# Altium schematic sheet Analog_project.SchDoc
size Letter; SheetNumber: 1; SheetTotal: 1
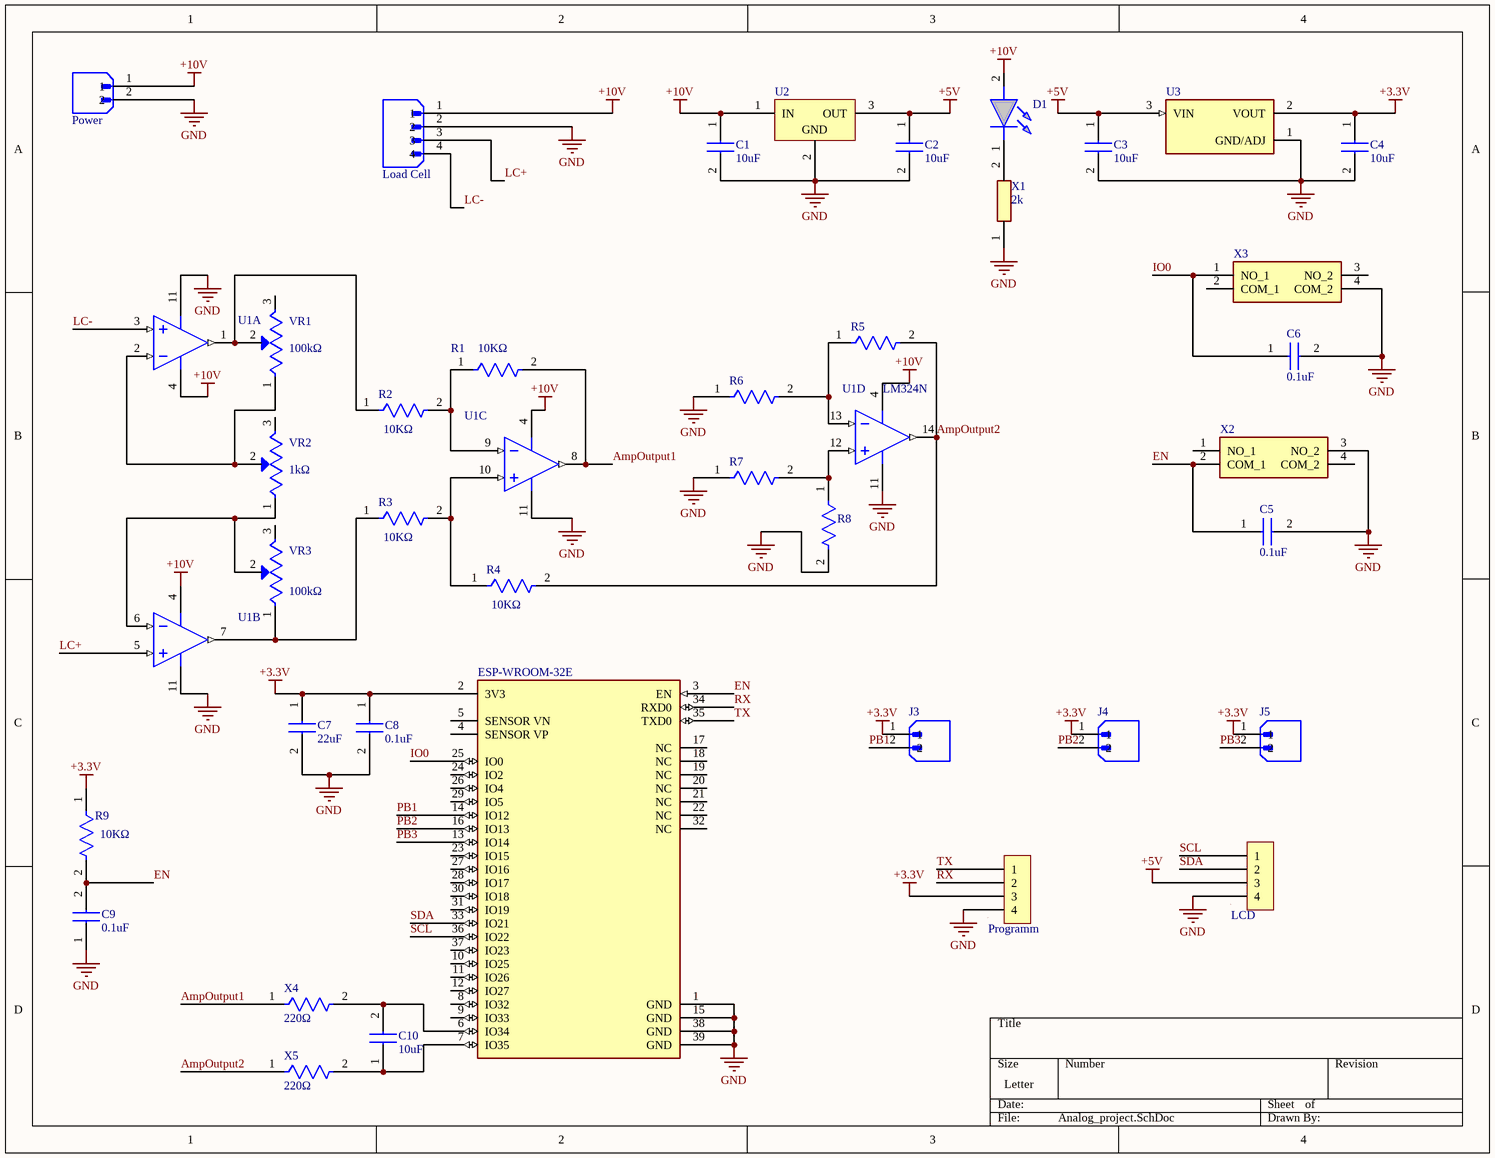
[diagram p0: Analog_project.SchDoc]

## Parts
C1  Capacitance: 10uF  [CAPC3216X180N]  (hidden comment: C1206C106K8RAC)
C2  Capacitance: 10uF  [CAPC3216X180N]  (hidden comment: C1206C106K8RAC)
C3  Capacitance: 10uF  [CAPC3216X180N]  (hidden comment: C1206C106K8RAC)
C4  Capacitance: 10uF  [CAPC3216X180N]  (hidden comment: C1206C106K8RAC)
C5  Capacitance: 0.1uF  [CAPC3216X110N]  (hidden comment: C1206C104K5RAC7867)
C6  Capacitance: 0.1uF  [CAPC3216X110N]  (hidden comment: C1206C104K5RAC7867)
C7  Capacitamce: 22uF  [CAPC2012X150N]  (hidden comment: CL31B226KPKVPJE)
C8  Capacitance: 0.1uF  [CAPC3216X110N]  (hidden comment: C1206C104K5RAC7867)
C9  Capacitance: 0.1uF  [CAPC3216X110N]  (hidden comment: C1206C104K5RAC7867)
C10  Capacitance: 10uF  [CAPC3216X180N]  (hidden comment: C1206C106K8RAC)
D1  150120GS75000  [LEDC3214X78N]  (value not drawn)
ESP-WROOM-32E  ESP32-WROOM-32E (16MB)  [FP-ESP32-WROOM-32E_16MB-MFG]  (value not drawn)
J3  B2B-XH-A(LF)(SN)  [JST_B2B-XH-A(LF)(SN)]  (value not drawn)
J4  B2B-XH-A(LF)(SN)  [JST_B2B-XH-A(LF)(SN)]  (value not drawn)
J5  B2B-XH-A(LF)(SN)  [JST_B2B-XH-A(LF)(SN)]  (value not drawn)
LCD  61300411121  [61300411121]  (value not drawn)
Load_Cell  B4B-XH-A(LF)(SN)  [JST_B4B-XH-A(LF)(SN)]  (value not drawn)
Power  B2B-XH-A(LF)(SN)  [JST_B2B-XH-A(LF)(SN)]  (value not drawn)
Programm  61300411121  [61300411121]  (value not drawn)
R1  value 10KΩ  [FP-CRGP1210-IPC_A]  (hidden comment: CRGP1210F10K)
R2  value 10KΩ  [FP-CRGP1210-IPC_A]  (hidden comment: CRGP1210F10K)
R3  value 10KΩ  [FP-CRGP1210-IPC_A]  (hidden comment: CRGP1210F10K)
R4  value 10KΩ  [FP-CRGP1210-IPC_A]  (hidden comment: CRGP1210F10K)
R5  CRGP1210F10K  [FP-CRGP1210-IPC_A]  (value not drawn)
R6  CRGP1210F10K  [FP-CRGP1210-IPC_A]  (value not drawn)
R7  CRGP1210F10K  [FP-CRGP1210-IPC_A]  (value not drawn)
R8  CRGP1210F10K  [FP-CRGP1210-IPC_A]  (value not drawn)
R9  value 10KΩ  [FP-CRGP1210-IPC_A]  (hidden comment: CRGP1210F10K)
U1  LM324N  [N0014A]  (value not drawn)  (parts A,B,C,D of 4)
U2  L7805ACV  [TO220]  (value not drawn)
U3  AMS1117-3.3  [SOT229P700X180-4N]  (value not drawn)
VR1  value 100kΩ  [TRIM_3296W-OT1-103]  (hidden comment: 3296W-OT1-103)
VR2  value 1kΩ  [TRIM_3296W-OT1-103]  (hidden comment: 3296W-OT1-103)
VR3  value 100kΩ  [TRIM_3296W-OT1-103]  (hidden comment: 3296W-OT1-103)
X1  Resistance: 2k  [RESC3116X65X50LL20T20]  (hidden comment: CHP1206AFX-2001ELF)
X2  TS04-66-65-BK-160-SMT  [TS046665BK160SMT]  (value not drawn)
X3  TS04-66-65-BK-160-SMT  [TS046665BK160SMT]  (value not drawn)
X4  Resistance: 220Ω  [RESC3216X60N]  (hidden comment: RCC1206220RFKEA)
X5  Resistance: 220Ω  [RESC3216X60N]  (hidden comment: RCC1206220RFKEA)

## Nets
+3.3V: C4.1 C7.1 C8.1 ESP-WROOM-32E.2(3V3) J3.1 J4.1 J5.1 Programm.3 R9.1 U3.2(VOUT)
+5V: C2.1 C3.1 LCD.3 U2.3(OUT) U3.3(VIN)
+10V: C1.1 D1.2(A) Load_Cell.1 Power.1 U1.4(V+) U2.1(IN)
GND: C1.2 C2.2 C3.2 C4.2 C5.2 C6.2 C7.2 C8.2 C9.1 ESP-WROOM-32E.1(GND) ESP-WROOM-32E.15(GND) ESP-WROOM-32E.38(GND) ESP-WROOM-32E.39(GND) LCD.4 Load_Cell.2 Power.2 Programm.4 R6.1 R7.1 R8.2 U1.11(GND) U2.2(GND) U3.1(GND/ADJ) X1.1 X2.3(NO_2) X3.4(COM_2)
AmpOutput1: R1.2 U1.8(OUT3) X4.1
AmpOutput2: R4.2 R5.2 U1.14(OUT4) X5.1
EN: C5.1 C9.2 ESP-WROOM-32E.3(EN) R9.2 X2.2(COM_1)
IO0: C6.1 ESP-WROOM-32E.25(IO0) X3.1(NO_1)
LC+: Load_Cell.3 U1.5(IN2+)
LC-: Load_Cell.4 U1.3(IN1+)
PB1: ESP-WROOM-32E.14(IO12) J3.2
PB2: ESP-WROOM-32E.16(IO13) J4.2
PB3: ESP-WROOM-32E.13(IO14) J5.2
RX: ESP-WROOM-32E.34(RXD0) Programm.2
SCL: ESP-WROOM-32E.36(IO22) LCD.1
SDA: ESP-WROOM-32E.33(IO21) LCD.2
TX: ESP-WROOM-32E.35(TXD0) Programm.1
NetC10_1: C10.1 ESP-WROOM-32E.7(IO35) X5.2
NetC10_2: C10.2 ESP-WROOM-32E.6(IO34) X4.2
NetD1_1: D1.1(K) X1.2
NetR1_1: R1.1 R2.2 U1.9(IN3-)
NetR2_1: R2.1 U1.1(OUT1) VR1.2(WIPER)
NetR3_1: R3.1 U1.7(OUT2) VR3.1(CCW)
NetR3_2: R3.2 R4.1 U1.10(IN3+)
NetR5_1: R5.1 R6.2 U1.13(IN4-)
NetR7_2: R7.2 R8.1 U1.12(IN4+)
NetU1_2: U1.2(IN1-) VR1.1(CCW) VR2.2(WIPER)
NetU1_6: U1.6(IN2-) VR2.1(CCW) VR3.2(WIPER)

Not connected (* = marked no-connect by the designer): ESP-WROOM-32E 4(SENSOR_VP) 5(SENSOR_VN) 8(IO32) 9(IO33) 10(IO25) 11(IO26) 12(IO27) 17(NC) 18(NC) 19(NC) 20(NC) 21(NC) 22(NC) 23(IO15) 24(IO2) 26(IO4) 27(IO16) 28(IO17) 29(IO5) 30(IO18) 31(IO19) 32(NC) 37(IO23); VR1 3(CW); VR2 3(CW); VR3 3(CW); X2 1(NO_1) 4(COM_2); X3 2(COM_1) 3(NO_2)

## Library data of the parts
C1-C4 C10 = C1206C106K8RAC: Multilayer Ceramic Capacitors MLCC - SMD/SMT 10V 10uF X7R 1206 0.1; Manufacturer_Name: KEMET; Geometry.Height: 1.8mm; Mouser Part Number: 80-C1206C106K8RAC; Mouser Price/Stock: https://www.mouser.co.uk/ProductDetail/KEMET/C1206C106K8RAC?qs=IIhARexJuViDIgySPNv42g%3D%3D; Manufacturer_Part_Number: C1206C106K8RAC; Datasheet Link: https://www.mouser.in/datasheet/2/212/KEM_C1002_X7R_SMD-1102033.pdf
C5 C6 C8 C9 = C1206C104K5RAC7867: Multilayer Ceramic Capacitors MLCC - SMD/SMT 50V 0.1uF X7R 1206 10%; Manufacturer_Name: KEMET; Geometry.Height: 1.1mm; Mouser Part Number: 80-C1206104K5RAC7867; Mouser Price/Stock: https://www.mouser.co.uk/ProductDetail/KEMET/C1206C104K5RAC7867?qs=r%2FVmNO8Tjq5MvP%2FjoJQjcw%3D%3D; Manufacturer_Part_Number: C1206C104K5RAC7867; Datasheet Link: https://content.kemet.com/datasheets/KEM_C1002_X7R_SMD.pdf
C7 = CL31B226KPKVPJE: General Multilayer Ceramic Capacitors; Manufacturer_Name: SAMSUNG; Geometry.Height: 1.5mm; Mouser Part Number: 187-CL31B226KPKVPJE; Mouser Price/Stock: https://www.mouser.co.uk/ProductDetail/Samsung-Electro-Mechanics/CL31B226KPKVPJE?qs=Jm2GQyTW%2Fbh6Hm6JEZyOWg%3D%3D; Manufacturer_Part_Number: CL31B226KPKVPJE; Datasheet Link: *
D1 = 150120GS75000: LED,Wurth Elektronik,150120GS75000 Wurth Elektronik 150120GS75000, WL-SMCW Series Green LED, 520 nm, 3016 (1206) Clear, Rectangle Lens SMD Package; Geometry.Height: 0.78mm; Mouser Part Number: 710-150120GS75000; Mouser Price/Stock: https://www.mouser.co.uk/ProductDetail/Wurth-Elektronik/150120GS75000?qs=LlUlMxKIyB3I3AMxrmBw4A%3D%3D; Manufacturer_Name: Wurth Elektronik; Manufacturer_Part_Number: 150120GS75000; Datasheet Link: *
ESP-WROOM-32E = CMP-194065-000027-1: RX TXRX MOD WIFI TRACE ANT SMD
J3-J5 Power = B2B-XH-A(LF)(SN): Connector Header Through Hole 2 position 0.098 (2.50mm); MF: JST Sales America Inc.; SnapEDA_Link: https://www.snapeda.com/parts/B2B-XH-A(LF)(SN)/JST+Sales+America+Inc./view-part/?ref=snap; Package: None; Value: *; MP: B2B-XH-A(LF)(SN); Check_prices: https://www.snapeda.com/parts/B2B-XH-A(LF)(SN)/JST+Sales+America+Inc./view-part/?ref=eda
LCD Programm = 61300411121: Board Connector, 4 Contact(s), 1 Row(s), Male, Straight, 0.1 inch Pitch, Solder Terminal, Locking, Black Insulator, Plug; Manufacturer: Wurth Electronics; Contact Pattern: RECTANGULAR; Contact Resistance: 20mR; Contact Style: SQ PIN-SKT; Dielectric Withstanding Voltage (AC): 500V; Insulation Resistance: 1GR; Number Of Connectors: 1; Rated Current (Signal): 3A; Number of Contacts: 4; Body Length: 0.4inch; Reference Standard: UL; Reliability: COMMERCIAL; Supplier: Digi-Key; Supplier Part Number: 732-5317-ND; Manufacturer Part Number: 61300411121; RoHS: Yes; Category: Headers and Wire Housings; Stock: 103058; Pricing: 1=0.19, 10=0.163, 25=0.1352, 50=0.113, 100=0.102, 1000=0.094 (USD); Mounting Technology: Board; Contact Material: Copper Alloy; Contact Finish - Mating: GOLD; Contact Finish - Termination: Gold (Au) - with Nickel (Ni) barrier; Insulation Color: Black; Insulation Material: Polybutylene; Min Operating Temperature: -40°C; Max Operating Temperature: 125°C; Connector Type: BOARD CONNECTOR; JESD-609 Code: e4; Body/Shell Style: PLUG; Contact Gender: Male; Mounting Style: STRAIGHT; Number of Rows Loaded: 1; PCB Contact Pattern: RECTANGULAR; Termination: Solder; Body Breadth: 0.1inch; Body Depth: 0.1inch; Mating Contact Pitch: 0.1inch; Mounting Option 1: LOCKING; Terminal Length: 0.118inch; Terminal Pitch: 2.54mm; Reach SVHC Compliant: Yes; RoHS Compliant: Yes; ComponentLink1URL: https://datasheet.ciiva.com:443/pdfs/VipMasterIC/IC/MIDC/MIDCS07676/MIDCS07676-1.pdf?src-supplier=IHS+Markit; ComponentLink1Description: https://datasheet.ciiva.com:443/pdfs/VipMasterIC/IC/MIDC/MIDCS07676/MIDCS07676-1.pdf?src-supplier=IHS+Markit; ComponentLink2URL: http://www.farnell.com/cad/1737268.pdf?src-supplier=Element14; ComponentLink2Description: http://www.farnell.com/cad/1737268.pdf?src-supplier=Element14; ComponentLink3URL: https://katalog.we-online.de/em/datasheet/6130xx11121.pdf?src-supplier=Digi-Key; ComponentLink3Description: https://katalog.we-online.de/em/datasheet/6130xx11121.pdf?src-supplier=Digi-Key
Load_Cell = B4B-XH-A(LF)(SN): Connector Header Through Hole 4 position 0.098 (2.50mm); MF: JST Sales; SnapEDA_Link: https://www.snapeda.com/parts/B4B-XH-A(LF)(SN)/JST+Sales+America+Inc./view-part/?ref=snap; Package: None; MP: B4B-XH-A(LF)(SN); Check_prices: https://www.snapeda.com/parts/B4B-XH-A(LF)(SN)/JST+Sales+America+Inc./view-part/?ref=eda; Purchase-URL: https://pricing.snapeda.com/search/part/B4B-XH-A(LF)(SN)/?ref=eda; Price: None; Value: *; Availability: In Stock
R1-R9 = CMP-03211-008532-1: CRGP1210 10KΩ 0.75W ±100ppm/°C 1% 200V; Manufacturer: TE; Tolerance: 0.01; Package: CRGP1210; Octopart: https://octopart.com/crgp1210f10k-te+connectivity-91018904; Device Class L2: Resistors; Temperature Coefficient: ±100ppm/°C; Resistance: 10KΩ; ComponentLink2URL: https://www.te.com/commerce/DocumentDelivery/DDEController?Action=srchrtrv&DocNm=9-1773463-9&DocType=Data+Sheet&DocLang=English&DocFormat=pdf&PartCntxt=4-2176329-922; ComponentLink2Description: Datasheet; Voltage Rating: 200V; Device Class L3: Chip SMD Resistors; Manufacturer Part Number: CRGP1210F10K; Height: 0.65mm; Temperature Range Low: -55°C; Category: Res; Series: CRGP; Lead Free: Yes; RoHS: TRUE; Device Class L1: Passive Components; Composition: Thick Film; Temperature Range High: +155°C; Temperature: -55°C to +155°C; Power Rating: 0.75W; Ipc Land Pattern Name: RESC310260X55; Automotive: No
  R5-R8: Value: 10KΩ
U1 = CMP-0055-00082-3: Low Power Quad Operational Amplifier, 14-pin MDIP; Manufacturer: Texas Instruments; CompType: Amplifiers; PowerWise: N; PackageTopMarking: NSUZXYYTTE#*LM324N; PackageDescription: MDIP, .750 x .250 x.130in, 14 Lead, .100in Pitch; Package Reference: N0014A; RoHS: N; Code_JEDEC: MS-001-AA; ComponentLink1URL: http://www.ti.com/general/docs/lit/getliterature.tsp?genericPartNumber=LM324&fileType=pdf; ComponentLink1Description: Datasheet URL; PinCount: 14
U2 = CMP-0244-00484-1: Positive Voltage Regulator, 5V, 3-Pin TO-220; DatasheetVersion: 16/11/2011; ComponentLink2Description: Datasheet; ComponentLink3Description: Package Specification; ComponentLink2URL: http://www.st.com/internet/com/TECHNICAL_RESOURCES/TECHNICAL_LITERATURE/DATASHEET/CD00000444.pdf; PackageDescription: TO, Thru-Hole, Vertical, Heatsink Mounted; 3 In-Line Leads; Pitch 2.54 mm; ComponentLink3URL: http://www.st.com/internet/com/TECHNICAL_RESOURCES/TECHNICAL_LITERATURE/PACKAGE_INFORMATION/CD00004649.pdf; PackageReference: TO220; ComponentLink1URL: http://www.st.com; PackageVersion: ver3.0; ComponentLink1Description: Manufacturer URL
U3 = AMS1117-3.3: Sot223/Pkg 1-Amp 3.3-Volt Low Drop Out Voltage Regulatator; MF: Advanced Monolithic Systems; Package: SOT-223 Seeed Technology; Value: *; Check_prices: https://www.snapeda.com/parts/AMS1117-3.3/Advanced+Monolithic+Systems/view-part/?ref=eda; Price: None; Availability: Not in stock; MP: AMS1117-3.3; SnapEDA_Link: https://www.snapeda.com/parts/AMS1117-3.3/Advanced+Monolithic+Systems/view-part/?ref=snap
VR1-VR3 = 3296W-OT1-103: Potentiometers, multi, Resistors, trimmer, cermet, potentiometers, turn, sealed, Potentiometers and Accessories, Pass...; MF: Bourns; SnapEDA_Link: https://www.snapeda.com/parts/3296W-OT1-103/Bourns/view-part/?ref=snap; Package: SOT-23-5 Bourns; MP: 3296W-OT1-103; Check_prices: https://www.snapeda.com/parts/3296W-OT1-103/Bourns/view-part/?ref=eda; Price: None; Availability: Not in stock
X1 = CHP1206AFX-2001ELF: Thick Film Resistors - SMD ResHighPowerA 1206 2k 1% 3/4W TC100 AEC-Q200; Manufacturer_Name: Bourns; Geometry.Height: 0.65mm; Mouser Part Number: 652-CHP1206AFX-2001L; Mouser Price/Stock: https://www.mouser.co.uk/ProductDetail/Bourns/CHP1206AFX-2001ELF?qs=GedFDFLaBXERFI3Dnxqg6Q%3D%3D; Manufacturer_Part_Number: CHP1206AFX-2001ELF; Datasheet Link: https://www.mouser.mx/datasheet/2/54/chp-a-1858677.pdf
X2 X3 = TS04-66-65-BK-160-SMT: Tactile Switches 6 x 6 mm, 6.5 mm Act Height, 160 gf, Black, Surface Mount, SPST,; Manufacturer_Name: CUI Devices; Geometry.Height: 6.7mm; Mouser Part Number: 179-TS046665BK160SMT; Mouser Price/Stock: https://www.mouser.co.uk/ProductDetail/CUI-Devices/TS04-66-65-BK-160-SMT?qs=A6eO%252BMLsxmTgRLoTHWtDYQ%3D%3D; Manufacturer_Part_Number: TS04-66-65-BK-160-SMT; Datasheet Link: https://www.cuidevices.com/product/resource/ts04.pdf
X4 X5 = RCC1206220RFKEA: Thick Film Resistors - SMD 220ohms 1% 100ppm; Manufacturer_Name: Vishay; Geometry.Height: 0.6mm; Mouser Part Number: 71-RCC1206220RFKEA; Mouser Price/Stock: https://www.mouser.co.uk/ProductDetail/Vishay-Dale/RCC1206220RFKEA?qs=IS%252B4QmGtzzrRn9QnSak10Q%3D%3D; Manufacturer_Part_Number: RCC1206220RFKEA; Datasheet Link: https://4donline.ihs.com/images/VipMasterIC/IC/VISH/VISH-S-A0011718072/VISH-S-A0011718072-1.pdf?hkey=6D3A4C79FDBF58556ACFDE234799DDF0